# EAGLE design PIC-adresseur - SuperCAST (EAGLE 9.5.2)
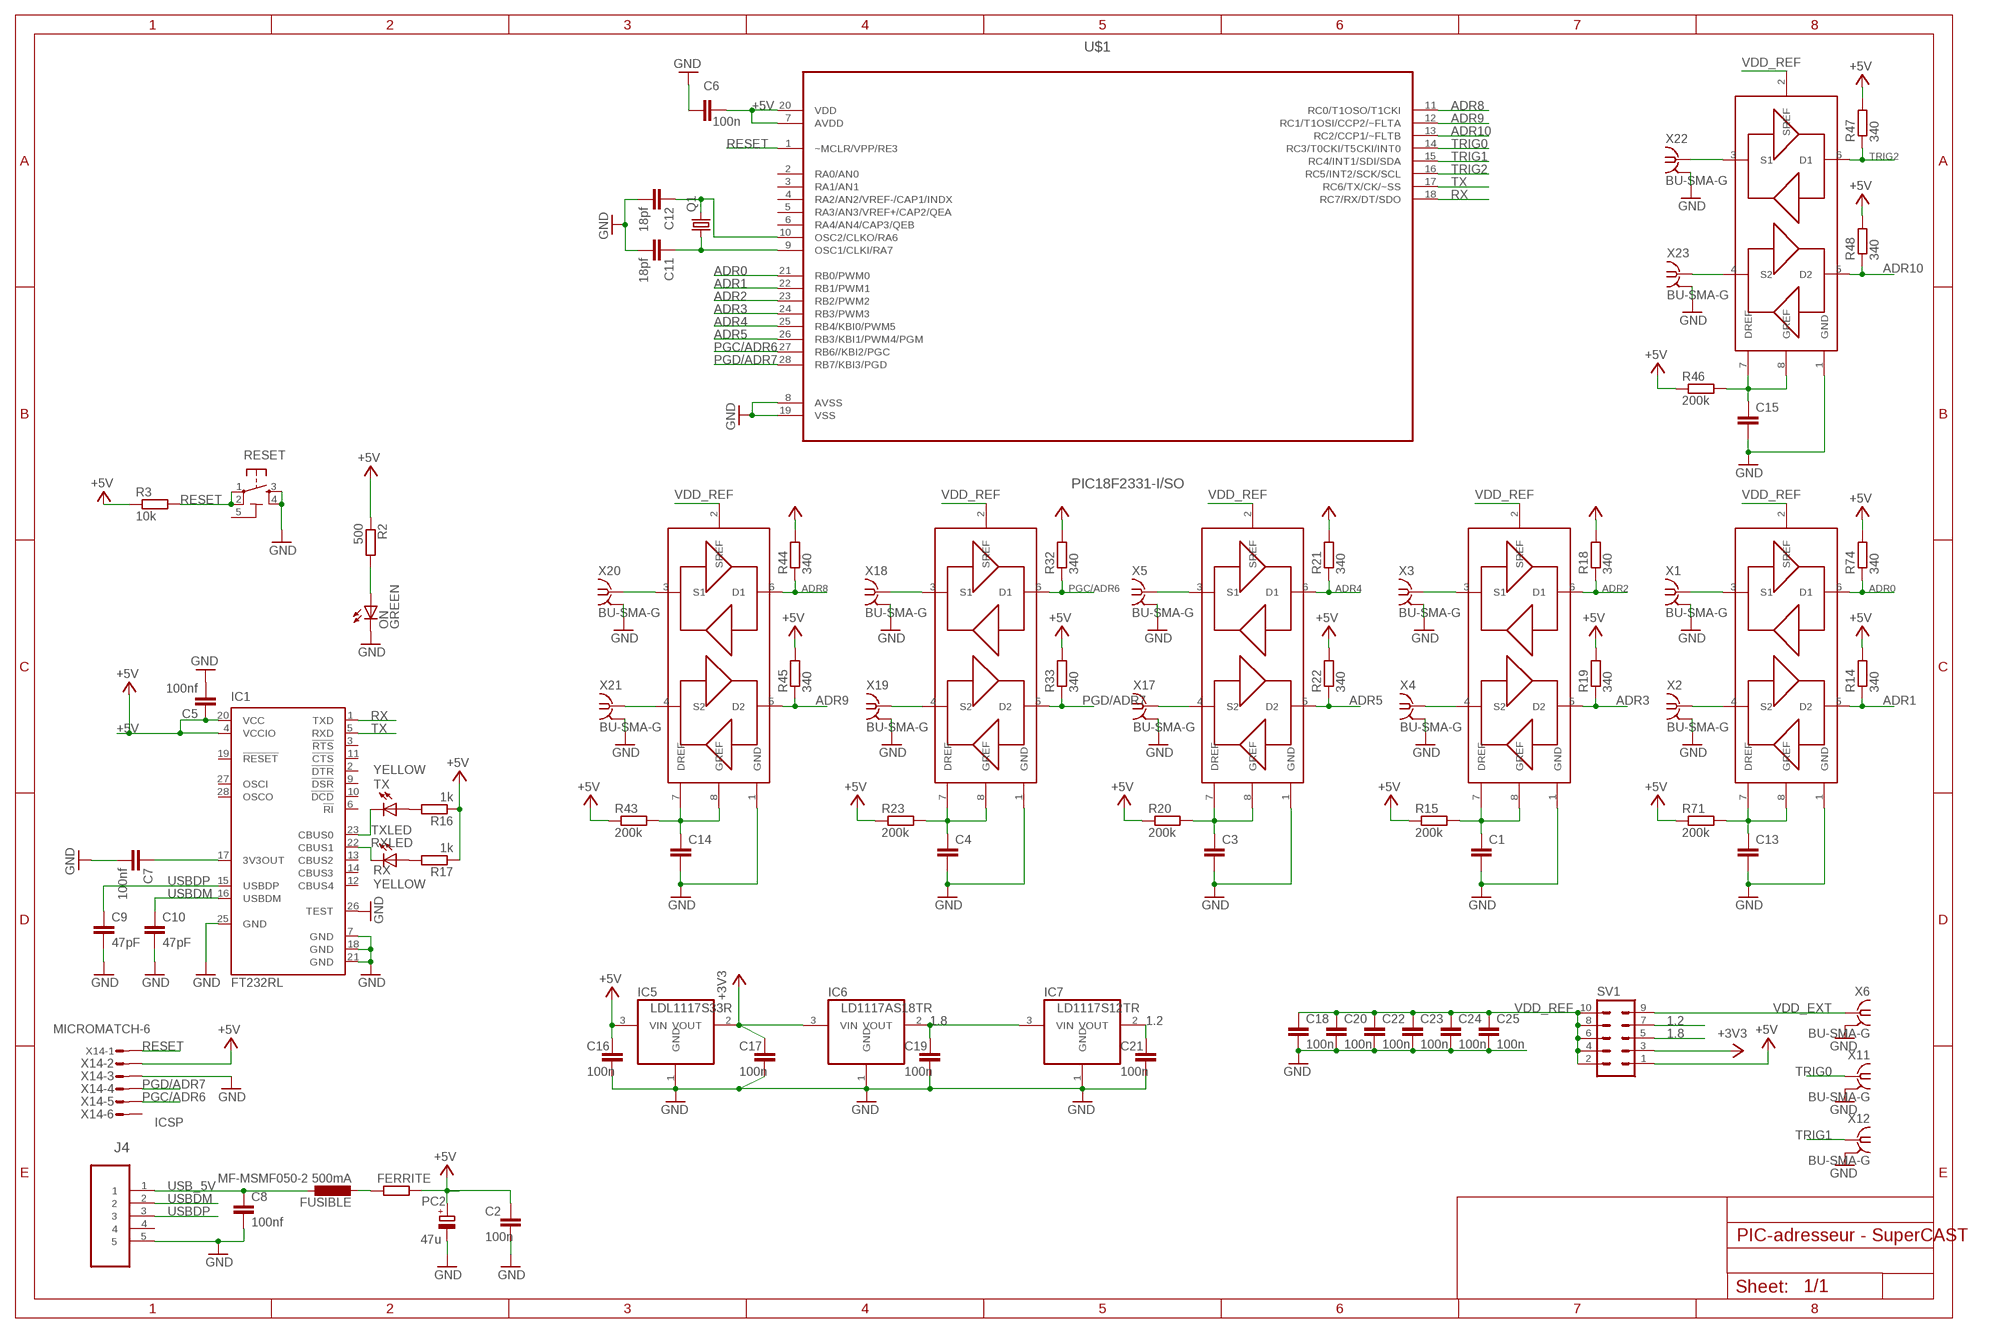
[diagram p0: schematic, sheet 1]

## Parts
C1  C-EUC0603  [C0603]
C2  100n  C-EU0603-RND  [C0603-ROUND]
C3  C-EUC0603  [C0603]
C4  C-EUC0603  [C0603]
C5  100nf  C-EUC0603  [C0603]
C6  100n  C-EUC0603K  [C0603K]
C7  100nf  C-EUC0603  [C0603]
C8  100nf  C-EUC0603  [C0603]
C9  47pF  C-EUC0603  [C0603]
C10  47pF  C-EUC0603  [C0603]
C11  18pf  C-EUC0603  [C0603]
C12  18pf  C-EUC0603  [C0603]
C13  C-EUC0603  [C0603]
C14  C-EUC0603  [C0603]
C15  C-EUC0603  [C0603]
C16  100n  C-EU0603-RND  [C0603-ROUND]
C17  100n  C-EU0603-RND  [C0603-ROUND]
C18  100n  C-EUC0603  [C0603]
C19  100n  C-EU0603-RND  [C0603-ROUND]
C20  100n  C-EUC0603  [C0603]
C21  100n  C-EU0603-RND  [C0603-ROUND]
C22  100n  C-EUC0603  [C0603]
C23  100n  C-EUC0603  [C0603]
C24  100n  C-EUC0603  [C0603]
C25  100n  C-EUC0603  [C0603]
FERRITE  R-EU_M0805  [M0805]
FUSIBLE  MF-MSMF050-2 500mA  L-EUL1812  [L1812]
IC1  FT232RL  [SSOP28]
IC5  LDL1117S33R  REG1117  [SOT223]
IC6  LD1117AS18TR  REG1117  [SOT223]
IC7  LD1117S12TR  REG1117  [SOT223]
J4  47346-0001  [MOLEX_47346-0001]
LV_LVLC1  GTL2002DP_118  [GTL2002DP_118]
LV_LVLC2  GTL2002DP_118  [GTL2002DP_118]
LV_LVLC3  GTL2002DP_118  [GTL2002DP_118]
LV_LVLC4  GTL2002DP_118  [GTL2002DP_118]
LV_LVLC5  GTL2002DP_118  [GTL2002DP_118]
LV_LVLC6  GTL2002DP_118  [GTL2002DP_118]
ON  GREEN  LEDCHIP-LED0805  [CHIP-LED0805]
PC2  47u  CPOL-EUD  [PANASONIC_D]
Q1  CRYSTALSM49  [SM49]
R2  500  R-EU_R0603  [R0603]
R3  10k  R-EU_R0603  [R0603]
R14  340  R-EU_R0603  [R0603]
R15  200k  R-EU_R0603  [R0603]
R16  1k  R-EU_R0603  [R0603]
R17  1k  R-EU_R0603  [R0603]
R18  340  R-EU_R0603  [R0603]
R19  340  R-EU_R0603  [R0603]
R20  200k  R-EU_R0603  [R0603]
R21  340  R-EU_R0603  [R0603]
R22  340  R-EU_R0603  [R0603]
R23  200k  R-EU_R0603  [R0603]
R32  340  R-EU_R0603  [R0603]
R33  340  R-EU_R0603  [R0603]
R43  200k  R-EU_R0603  [R0603]
R44  340  R-EU_R0603  [R0603]
R45  340  R-EU_R0603  [R0603]
R46  200k  R-EU_R0603  [R0603]
R47  340  R-EU_R0603  [R0603]
R48  340  R-EU_R0603  [R0603]
R71  200k  R-EU_R0603  [R0603]
R74  340  R-EU_R0603  [R0603]
RESET  TS42031-160R-TR-7260  TS42  [TS42]
RX  YELLOW  LEDCHIP-LED0805  [CHIP-LED0805]
SV1  MA05-2  [MA05-2]
TX  YELLOW  LEDCHIP-LED0805  [CHIP-LED0805]
U$1  PIC18F2331-I/SO  [SOIC127P1030X265-28N]
X1  BU-SMA-G  [BU-SMA-G]
X2  BU-SMA-G  [BU-SMA-G]
X3  BU-SMA-G  [BU-SMA-G]
X4  BU-SMA-G  [BU-SMA-G]
X5  BU-SMA-G  [BU-SMA-G]
X6  BU-SMA-G  [BU-SMA-G]
X11  BU-SMA-G  [BU-SMA-G]
X12  BU-SMA-G  [BU-SMA-G]
X14  MICROMATCH-6  [MICROMATCH-6]
X17  BU-SMA-G  [BU-SMA-G]
X18  BU-SMA-G  [BU-SMA-G]
X19  BU-SMA-G  [BU-SMA-G]
X20  BU-SMA-G  [BU-SMA-G]
X21  BU-SMA-G  [BU-SMA-G]
X22  BU-SMA-G  [BU-SMA-G]
X23  BU-SMA-G  [BU-SMA-G]

## Nets
1.2: C21.2 IC7.2(VOUT) SV1.7
1.8: C19.2 IC6.2(VOUT) IC7.3(VIN) SV1.5
+3V3: C17.2 IC5.2(VOUT) IC6.3(VIN) SV1.3
+5V [usbvcc]: C2.2 C5.1 C6.2 C16.2 FERRITE.2 IC1.4(VCCIO) IC1.20(VCC) IC5.3(VIN) PC2.+ R2.1 R3.1 R14.2 R15.1 R16.1 R17.1 R18.2 R19.2 R20.1 R21.2 R22.2 R23.1 R32.2 R33.2 R43.1 R44.2 R45.2 R46.1 R47.2 R48.2 R71.1 R74.2 SV1.1 U$1.7(AVDD) U$1.20(VDD) X14.2
ADR0: LV_LVLC2.6(D1) R74.1 U$1.21(RB0/PWM0)
ADR0OUT: LV_LVLC2.3(S1) X1.1
ADR1: LV_LVLC2.5(D2) R14.1 U$1.22(RB1/PWM1)
ADR1OUT: LV_LVLC2.4(S2) X2.1
ADR2: LV_LVLC1.6(D1) R18.1 U$1.23(RB2/PWM2)
ADR2OUT: LV_LVLC1.3(S1) X3.1
ADR3: LV_LVLC1.5(D2) R19.1 U$1.24(RB3/PWM3)
ADR3OUT: LV_LVLC1.4(S2) X4.1
ADR4: LV_LVLC3.6(D1) R21.1 U$1.25(RB4/KBI0/PWM5)
ADR4OUT: LV_LVLC3.3(S1) X5.1
ADR5: LV_LVLC3.5(D2) R22.1 U$1.26(RB3/KBI1/PWM4/PGM)
ADR5OUT: LV_LVLC3.4(S2) X17.1
ADR6OUT: LV_LVLC4.3(S1) X18.1
ADR7OUT: LV_LVLC4.4(S2) X19.1
ADR8: LV_LVLC5.6(D1) R44.1 U$1.11(RC0/T1OSO/T1CKI)
ADR8OUT: LV_LVLC5.3(S1) X20.1
ADR9: LV_LVLC5.5(D2) R45.1 U$1.12(RC1/T1OSI/CCP2/~FLTA)
ADR9OUT: LV_LVLC5.4(S2) X21.1
ADR10: LV_LVLC6.5(D2) R48.1 U$1.13(RC2/CCP1/~FLTB)
ADR10OUT: LV_LVLC6.4(S2) X23.1
GND [gnd]: C1.2 C2.1 C3.2 C4.2 C5.2 C6.1 C7.2 C8.2 C9.2 C10.2 C11.2 C12.2 C13.2 C14.2 C15.2 C16.1 C17.1 C18.2 C19.1 C20.2 C21.1 C22.2 C23.2 C24.2 C25.2 IC1.7(GND) IC1.18(GND) IC1.21(GND) IC1.25(GND) IC1.26(TEST) IC5.1(GND) IC6.1(GND) IC7.1(GND) J4.5 LV_LVLC1.1(GND) LV_LVLC2.1(GND) LV_LVLC3.1(GND) LV_LVLC4.1(GND) LV_LVLC5.1(GND) LV_LVLC6.1(GND) ON.C PC2.- RESET.3 RESET.4 U$1.8(AVSS) U$1.19(VSS) X1.2 X1.3 X1.4 X1.5 X2.2 X2.3 X2.4 X2.5 X3.2 X3.3 X3.4 X3.5 X4.2 X4.3 X4.4 X4.5 X5.2 X5.3 X5.4 X5.5 X6.2 X6.3 X6.4 X6.5 X11.2 X11.3 X11.4 X11.5 X12.2 X12.3 X12.4 X12.5 X14.3 X17.2 X17.3 X17.4 X17.5 X18.2 X18.3 X18.4 X18.5 X19.2 X19.3 X19.4 X19.5 X20.2 X20.3 X20.4 X20.5 X21.2 X21.3 X21.4 X21.5 X22.2 X22.3 X22.4 X22.5 X23.2 X23.3 X23.4 X23.5
N$3: ON.A R2.2
N$16: C7.1 IC1.17(3V3OUT)
N$17: C1.1 LV_LVLC1.7(DREF) LV_LVLC1.8(GREF) R15.2
N$18: FERRITE.1 FUSIBLE.2
N$20: C3.1 LV_LVLC3.7(DREF) LV_LVLC3.8(GREF) R20.2
N$31: C4.1 LV_LVLC4.7(DREF) LV_LVLC4.8(GREF) R23.2
N$33: C14.1 LV_LVLC5.7(DREF) LV_LVLC5.8(GREF) R43.2
N$35: R17.2 RX.A
N$36: R16.2 TX.A
N$37: C15.1 LV_LVLC6.7(DREF) LV_LVLC6.8(GREF) R46.2
N$119: C13.1 LV_LVLC2.7(DREF) LV_LVLC2.8(GREF) R71.2
PGC/ADR6: LV_LVLC4.6(D1) R32.1 U$1.27(RB6//KBI2/PGC) X14.5
PGD/ADR7: LV_LVLC4.5(D2) R33.1 U$1.28(RB7/KBI3/PGD) X14.4
RESET: R3.2 RESET.1 RESET.2 U$1.1(~MCLR/VPP/RE3) X14.1
RX: IC1.1(TXD) U$1.18(RC7/RX/DT/SDO)
RXLED: IC1.22(CBUS1) RX.C
TRIG0: U$1.14(RC3/T0CKI/T5CKI/INT0) X11.1
TRIG1: U$1.15(RC4/INT1/SDI/SDA) X12.1
TRIG2: LV_LVLC6.6(D1) R47.1 U$1.16(RC5/INT2/SCK/SCL)
TRIG2OUT: LV_LVLC6.3(S1) X22.1
TX: IC1.5(RXD) U$1.17(RC6/TX/CK/~SS)
TXLED: IC1.23(CBUS0) TX.C
USB_5V: C8.1 FUSIBLE.1 J4.1
USBDM: C10.1 IC1.16(USBDM) J4.2
USBDP: C9.1 IC1.15(USBDP) J4.3
VDD_EXT: SV1.9 X6.1
VDD_REF: C18.1 C20.1 C22.1 C23.1 C24.1 C25.1 LV_LVLC1.2(SREF) LV_LVLC2.2(SREF) LV_LVLC3.2(SREF) LV_LVLC4.2(SREF) LV_LVLC5.2(SREF) LV_LVLC6.2(SREF) SV1.2 SV1.4 SV1.6 SV1.8 SV1.10
XTAL1: C12.1 Q1.2 U$1.10(OSC2/CLKO/RA6)
XTAL2: C11.1 Q1.1 U$1.9(OSC1/CLKI/RA7)
Unconnected: IC1.2(!DTR) IC1.3(!RTS) IC1.6(!RI) IC1.9(!DSR) IC1.10(!DCD) IC1.11(!CTS) IC1.12(CBUS4) IC1.13(CBUS2) IC1.14(CBUS3) IC1.19(!RESET) IC1.27(OSCI) IC1.28(OSCO) J4.4 U$1.2(RA0/AN0) U$1.3(RA1/AN1) U$1.4(RA2/AN2/VREF-/CAP1/INDX) U$1.5(RA3/AN3/VREF+/CAP2/QEA) U$1.6(RA4/AN4/CAP3/QEB) X14.6

## Notes on the sheet
- ICSP

## Power pins joined to a net without a drawn wire
5-GND: RESET.5(5-GND)

## Library data of the parts
C1 C3 C4 C13-C15 = rcl:C-EU: CAPACITOR, European symbol; SPICEPREFIX: C
C2 C6 C16 C17 C19 C21 = SmartPrj:C-EU: CAPACITOR, European symbol; OC_FARNELL: 2210925
C5 C7 C8 C18 C20 C22-C25 = LibPerso:C-EU: CAPACITOR, European symbol; OC_FARNELL: 2210925
C9 C10 = LibPerso:C-EU: CAPACITOR, European symbol; OC_FARNELL: 1740601
C11 C12 = LibPerso:C-EU: CAPACITOR, European symbol; OC_FARNELL: 1740595
FERRITE = LibPerso:R-EU_: RESISTOR, European symbol; OC_FARNELL: 2292459
FUSIBLE = rcl:L-EU: INDUCTOR, European symbol; OC_FARNELL: 2396061
IC1 = ftdichip:FT232R: Source: http://www.ftdichip.com/Documents/DataSheets/DS_FT232R_v104.pdf; MPN: FT232RL; OC_FARNELL: 1146032; OC_NEWARK: 91K9918
IC5 = burr-brown:REG1117: 800mA and 1A Low Dropout (LDO) Positive Regulator 1.8V, 2.5V, 2.85V, 3.3V, 5V, and Adj; OC_FARNELL: 2729708
IC6 = burr-brown:REG1117: 800mA and 1A Low Dropout (LDO) Positive Regulator 1.8V, 2.5V, 2.85V, 3.3V, 5V, and Adj; OC_FARNELL: 1467775
IC7 = burr-brown:REG1117: 800mA and 1A Low Dropout (LDO) Positive Regulator 1.8V, 2.5V, 2.85V, 3.3V, 5V, and Adj; OC_FARNELL: 1467778
J4 = LibPerso:47346-0001: CONN RCPT 5POS MICRO USB R/A SMD; MPN: 47346-0001; OC_FARNELL: 1568026; OC_NEWARK: 47M0505; PACKAGE: 5 POS MICRO USB R/A; SUPPLIER: MOLEX
LV_LVLC1 = zitewo:GTL2002DP_118; OC8FARNELL: 2400476
LV_LVLC2-LV_LVLC6 = zitewo:GTL2002DP_118; OC_FARNELL: 2400476
ON = led:LED: LED OSRAM: - CHIPLED LG R971, LG N971, LY N971, LG Q971, LY Q971, LO R971, LY R971 LH N974, LH R974 LS Q976, LO Q976, LY Q976 LO Q996 - Hyper CHIPLED LW Q18S LB Q993, LB Q99A, LB R99A - SideLED LS A670, LO A670, LY A670, LG A670, LP A670 LB A673, LV A673, LT A673, LW A673 LH A674 LY A675 LS A676, LA A676, LO A676, LY A676, LW A676 LS A679, LY A679, LG A679 - Hyper Micro SIDELED® LS Y876, LA Y876, LO Y876, LY Y876 LT Y87S - SmartLED LW L88C, LW L88S LB L89C, LB L89S, LG L890 LS L89K, LO L89K, LY L89K LS L896, LA L896, LO L896, LY L896 - TOPLED LS T670, LO T670, LY T670, LG T670, LP T670 LSG T670, LSP T670, LSY T670, LOP T670, LYG T670 LG T671, LOG T671, LSG T671 LB T673, LV T673, LT T673, LW T673 LH T674 LS T676, LA T676, LO T676, LY T676, LB T676, LH T676, LSB T676, LW T676 LB T67C, LV T67C, LT T67C, LS T67K, LO T67K, LY T67K, LW E67C LS E67B, LA E67B, LO E67B, LY E67B, LB E67C, LV E67C, LT E67C LW T67C LS T679, LY T679, LG T679 LS T770, LO T770, LY T770, LG T770, LP T770 LB T773, LV T773, LT T773, LW T773 LH T774 LS E675, LA E675, LY E675, LS T675 LS T776, LA T776, LO T776, LY T776, LB T776 LHGB T686 LT T68C, LB T68C - Hyper Mini TOPLED® LB M676 - Mini TOPLED Santana® LG M470 LS M47K, LO M47K, LY M47K Source: http://www.osram.convergy.de LUXEON: - LUMILED® LXK2-PW12-R00, LXK2-PW12-S00, LXK2-PW14-U00, LXK2-PW14-V00 LXK2-PM12-R00, LXK2-PM12-S00, LXK2-PM14-U00 LXK2-PE12-Q00, LXK2-PE12-R00, LXK2-PE12-S00, LXK2-PE14-T00, LXK2-PE14-U00 LXK2-PB12-K00, LXK2-PB12-L00, LXK2-PB12-M00, LXK2-PB14-N00, LXK2-PB14-P00, LXK2-PB14-Q00 LXK2-PR12-L00, LXK2-PR12-M00, LXK2-PR14-Q00, LXK2-PR14-R00 LXK2-PD12-Q00, LXK2-PD12-R00, LXK2-PD12-S00 LXK2-PH12-R00, LXK2-PH12-S00 LXK2-PL12-P00, LXK2-PL12-Q00, LXK2-PL12-R00 Source: www.luxeon.com KINGBRIGHT: KA-3528ASYC Source: www.kingbright.com; OC_FARNELL: 8529906
PC2 = rcl:CPOL-EU: POLARIZED CAPACITOR, European symbol; OC_FARNELL: 1850100
Q1 = crystal:CRYSTAL: CRYSTAL; OC_FARNELL: 1842273; OC_NEWARK: unknown
R2 R3 R16 R17 = LibPerso:R-EU_: RESISTOR, European symbol; OC_FARNELL: 9331697
R14 R15 R18-R23 R32 R33 R43-R48 R71 R74 = rcl:R-EU_: RESISTOR, European symbol; SPICEPREFIX: R
RESET = SmartPrj:TS42: TS42 Dongnan Electronics Tact switch VDC 12V - 50mA; OC_FARNELL: 2060823
RX TX = led:LED: LED OSRAM: - CHIPLED LG R971, LG N971, LY N971, LG Q971, LY Q971, LO R971, LY R971 LH N974, LH R974 LS Q976, LO Q976, LY Q976 LO Q996 - Hyper CHIPLED LW Q18S LB Q993, LB Q99A, LB R99A - SideLED LS A670, LO A670, LY A670, LG A670, LP A670 LB A673, LV A673, LT A673, LW A673 LH A674 LY A675 LS A676, LA A676, LO A676, LY A676, LW A676 LS A679, LY A679, LG A679 - Hyper Micro SIDELED® LS Y876, LA Y876, LO Y876, LY Y876 LT Y87S - SmartLED LW L88C, LW L88S LB L89C, LB L89S, LG L890 LS L89K, LO L89K, LY L89K LS L896, LA L896, LO L896, LY L896 - TOPLED LS T670, LO T670, LY T670, LG T670, LP T670 LSG T670, LSP T670, LSY T670, LOP T670, LYG T670 LG T671, LOG T671, LSG T671 LB T673, LV T673, LT T673, LW T673 LH T674 LS T676, LA T676, LO T676, LY T676, LB T676, LH T676, LSB T676, LW T676 LB T67C, LV T67C, LT T67C, LS T67K, LO T67K, LY T67K, LW E67C LS E67B, LA E67B, LO E67B, LY E67B, LB E67C, LV E67C, LT E67C LW T67C LS T679, LY T679, LG T679 LS T770, LO T770, LY T770, LG T770, LP T770 LB T773, LV T773, LT T773, LW T773 LH T774 LS E675, LA E675, LY E675, LS T675 LS T776, LA T776, LO T776, LY T776, LB T776 LHGB T686 LT T68C, LB T68C - Hyper Mini TOPLED® LB M676 - Mini TOPLED Santana® LG M470 LS M47K, LO M47K, LY M47K Source: http://www.osram.convergy.de LUXEON: - LUMILED® LXK2-PW12-R00, LXK2-PW12-S00, LXK2-PW14-U00, LXK2-PW14-V00 LXK2-PM12-R00, LXK2-PM12-S00, LXK2-PM14-U00 LXK2-PE12-Q00, LXK2-PE12-R00, LXK2-PE12-S00, LXK2-PE14-T00, LXK2-PE14-U00 LXK2-PB12-K00, LXK2-PB12-L00, LXK2-PB12-M00, LXK2-PB14-N00, LXK2-PB14-P00, LXK2-PB14-Q00 LXK2-PR12-L00, LXK2-PR12-M00, LXK2-PR14-Q00, LXK2-PR14-R00 LXK2-PD12-Q00, LXK2-PD12-R00, LXK2-PD12-S00 LXK2-PH12-R00, LXK2-PH12-S00 LXK2-PL12-P00, LXK2-PL12-Q00, LXK2-PL12-R00 Source: www.luxeon.com KINGBRIGHT: KA-3528ASYC Source: www.kingbright.com; OC_FARNELL: 1686073
SV1 = con-lstb:MA05-2: PIN HEADER; OC_FARNELL: unknown; OC_NEWARK: unknown
U$1 = Microchip_By_element14_Batch_1:PIC18F2331-I/SO: High-Performance Enhanced Flash Microcontrollers; MPN: PIC18F2331-I/SO; OC_FARNELL: -; OC_NEWARK: 89H0559; PACKAGE: SOIC-28; SUPPLIER: Microchip
X1-X6 X11 X12 X17-X23 = con-coax:BU-SMA-G: FEMALE SMA CONNECTOR Radiall distributor RS 193-9117; OC_FARNELL: 1248989; OC_NEWARK: unknown
X14 = con-amp-micromatch:MICROMATCH-6: MicroMaTch 6 7-215464-6 / 0-215464-6 Drawing Number C-215464 DDEController.pdf; MPN: 7-215464-6; OC_FARNELL: 3784630; OC_NEWARK: 19R8125

## Net classes
1 power: width 0.61 mm, drill 0.61 mm, clearance 0.254 mm
2 gnd: width 0.305 mm, drill 0.559 mm, clearance 0.254 mm
3 usbvcc: width 0.508 mm, drill 0.61 mm, clearance 0.254 mm
4 aref: width 0.406 mm, drill 0.61 mm, clearance 0.254 mm

## Board
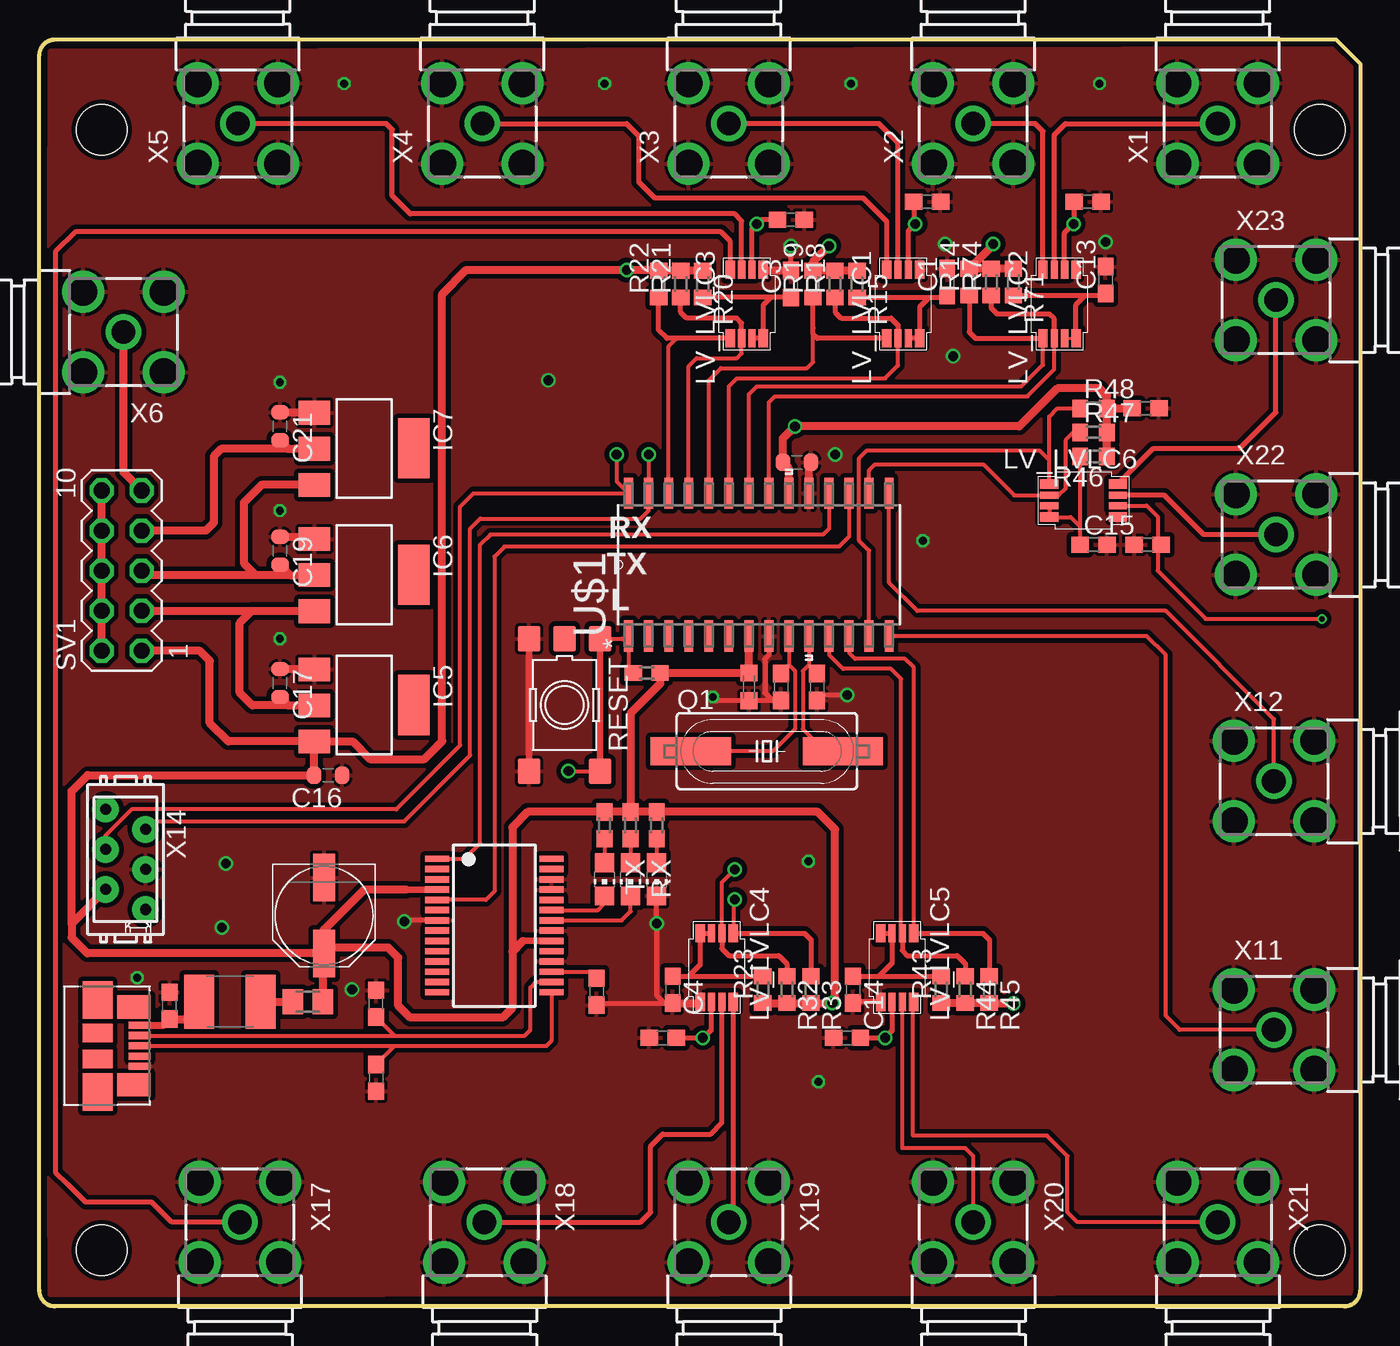
[diagram p1: board, top side]
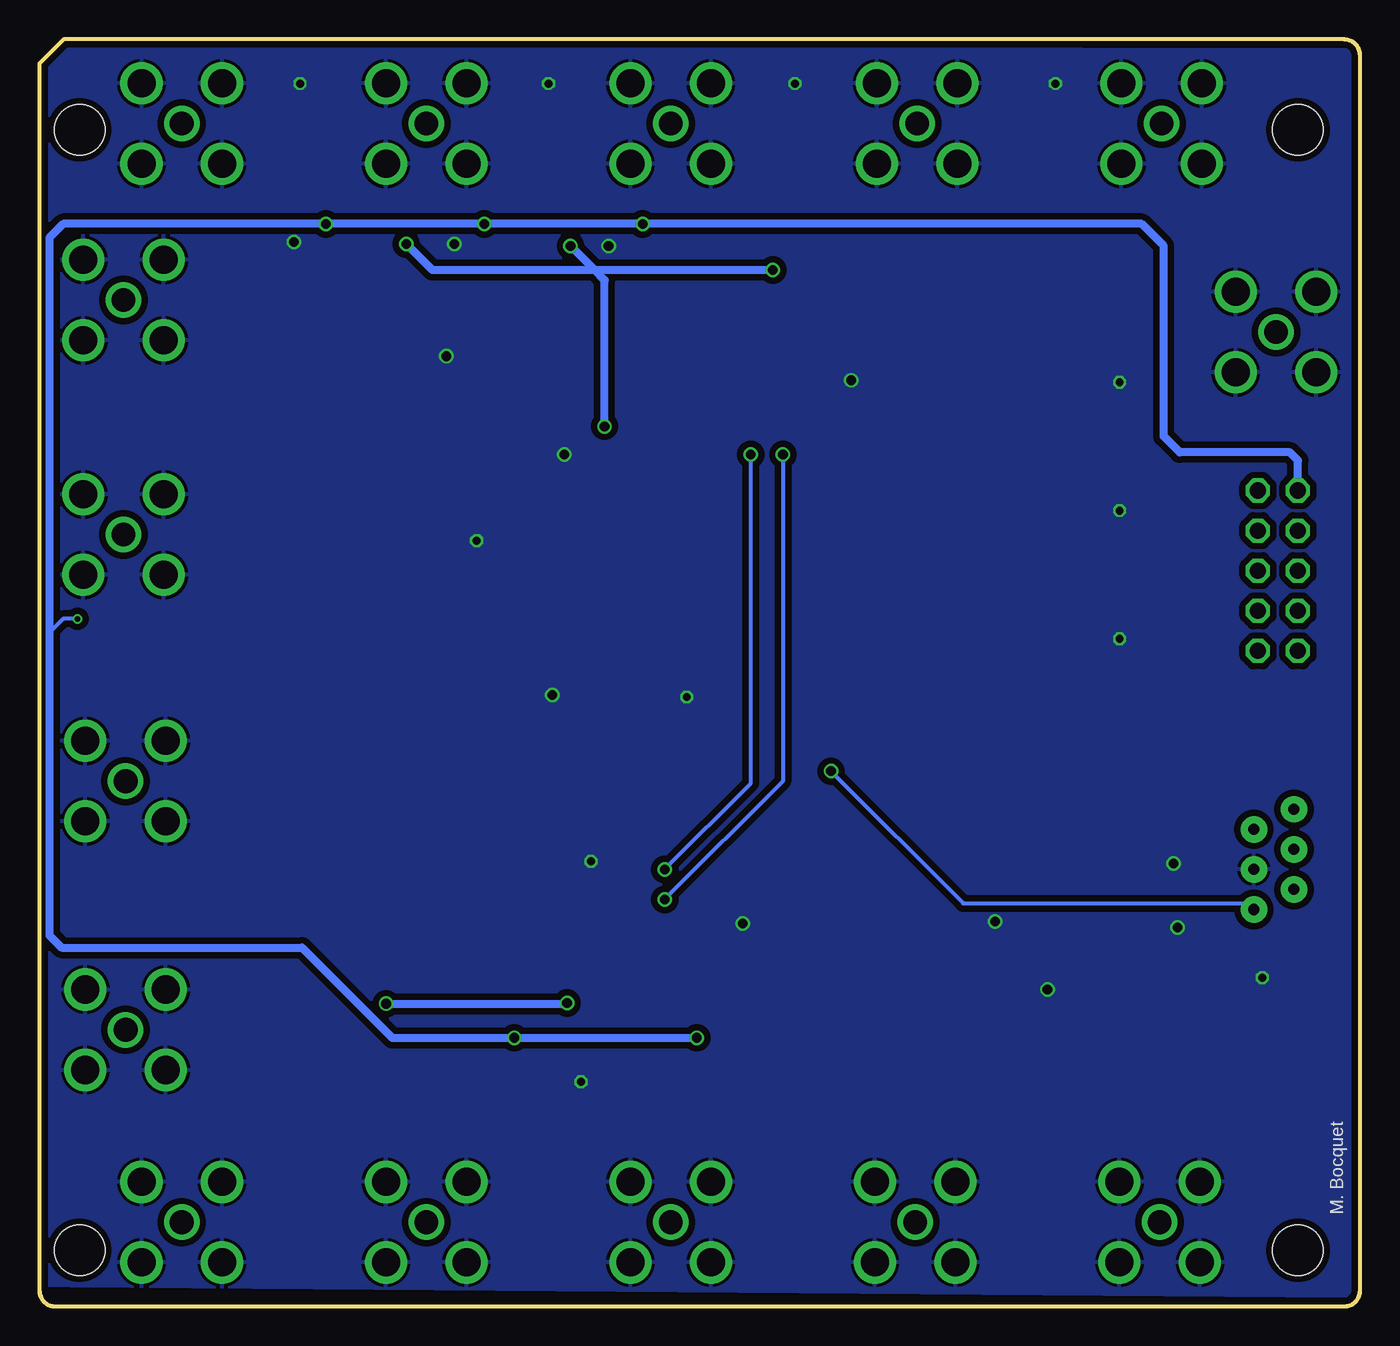
[diagram p2: board, bottom side, seen from below]

Size 83.69 x 80.26 mm. Coordinates in mm from the lower left corner, seen from the top.
Outline: 82.17,80.26 83.69,78.74 83.69,1 arc-90 82.69,0 1,0 arc-90 0,1 0,79.26 arc-90 1,80.26 82.17,80.26
Copper layers (1*16): Top 0.018mm / dielectric 1.55mm / Bottom 0.018mm
Design rules "eC_2Layer_PClass6_BaseCopperO18_eCDefault": minimum track width 0.15mm, minimum drill 0.35mm, track to track 0.15mm, track to pad 0.15mm, pad to pad 0.15mm, via to via 0.15mm, smd to smd 0mil, copper to edge 0.25mm, drill to drill 0.35mm, minimum pad ring 0.175mm, minimum via ring 0.125mm, stop-mask expansion 0mil, vias tented up to drill 0.45mm, thermal gap 0.2mm
Holes 3.2 mm at 81.15,74.55 81.15,3.56 3.94,3.56 3.94,74.55

### Footprints (pad centres in the part's own frame; a part is rotated, then mirrored left to right if it is on the bottom)
C0603 = smd 1.1 x 1: 1 -0.85,0; 2 0.85,0
C0603-ROUND = smd 0.898 x 1.1: 1 -0.889,0; 2 0.889,0
C0603K = smd 1.05 x 1.08: 1 -0.875,0; 2 0.875,0
M0805 = smd 1.3 x 1.6: 1 -0.95,0; 2 0.95,0
L1812 = smd 1.9 x 3.4: 1 -1.95,0; 2 1.95,0
SSOP28 = smd 0.4 x 1.5: 1 -4.225,-3.625; 2 -3.575,-3.625; 3 -2.925,-3.625; 4 -2.275,-3.625; 5 -1.625,-3.625; 6 -0.975,-3.625; 7 -0.325,-3.625; 8 0.325,-3.625; 9 0.975,-3.625; 10 1.625,-3.625; 11 2.275,-3.625; 12 2.925,-3.625; 13 3.575,-3.625; 14 4.225,-3.625; 15 4.225,3.625; 16 3.575,3.625; 17 2.925,3.625; 18 2.275,3.625; 19 1.625,3.625; 20 0.975,3.625; 21 0.325,3.625; 22 -0.325,3.625; 23 -0.975,3.625; 24 -1.625,3.625; 25 -2.275,3.625; 26 -2.925,3.625; 27 -3.575,3.625; 28 -4.225,3.625
SOT223 = smd 1.499 x 2.007: 1 -2.261,-3.15; 2 0.025,-3.15; 3 2.311,-3.15 | smd 3.81 x 2.007: 4 0,3.15
MOLEX_47346-0001 = smd 0.45 x 1.38: 1 -1.3,0; 2 -0.65,0; 3 0,0; 4 0.65,0; 5 1.3,0 | smd 1.475 x 2.1: M1 -2.462,-0.36; M2 2.462,-0.36 | smd 2.375 x 1.9: M3 -2.913,-2.66; M6 2.913,-2.66 | smd 1.175 x 1.9: M4 -0.82,-2.66; M5 0.85,-2.66
GTL2002DP_118 = smd 1.15 x 0.6: 1 -2.175,1.05; 4 -2.175,-1.05; 5 2.175,-1.05; 8 2.175,1.05 | smd 1.15 x 0.45: 2 -2.175,0.325; 3 -2.175,-0.325; 6 2.175,-0.325; 7 2.175,0.325
CHIP-LED0805 = smd 1.2 x 1.2: A 0,-1.05; C 0,1.05
PANASONIC_D = smd 3 x 1.4: + 2.4,0; - -2.4,0
SM49 = smd 5.08 x 1.778: 1 -4.826,0; 2 4.826,0
R0603 = smd 1.1 x 1: 1 -0.85,0; 2 0.85,0
R0603' = smd 1 x 1.1: 1 -0.85,0; 2 0.85,0
TS42 = smd 1.6 x 1.4: 1 -4.2,2.25; 2 4.2,2.25; 3 -4.2,-2.25; 4 4.2,-2.25; 5 -4.2,0
MA05-2 = drill 1.016 octagon: 1 -5.08,-1.27; 2 -5.08,1.27; 3 -2.54,-1.27; 4 -2.54,1.27; 5 0,-1.27; 6 0,1.27; 7 2.54,-1.27; 8 2.54,1.27; 9 5.08,-1.27; 10 5.08,1.27
SOIC127P1030X265-28N = smd 1.981 x 0.559: 1 -4.521,8.255; 2 -4.521,6.985; 3 -4.521,5.715; 4 -4.521,4.445; 5 -4.521,3.175; 6 -4.521,1.905; 7 -4.521,0.635; 8 -4.521,-0.635; 9 -4.521,-1.905; 10 -4.521,-3.175; 11 -4.521,-4.445; 12 -4.521,-5.715; 13 -4.521,-6.985; 14 -4.521,-8.255; 15 4.521,-8.255; 16 4.521,-6.985; 17 4.521,-5.715; 18 4.521,-4.445; 19 4.521,-3.175; 20 4.521,-1.905; 21 4.521,-0.635; 22 4.521,0.635; 23 4.521,1.905; 24 4.521,3.175; 25 4.521,4.445; 26 4.521,5.715; 27 4.521,6.985; 28 4.521,8.255
BU-SMA-G = drill 1.5: 1 0,0 | drill 1.778: 2 -2.55,2.55; 3 2.55,2.55; 4 2.55,-2.55; 5 -2.55,-2.55
MICROMATCH-6 = drill 0.7 pad 1.676: 1 3.175,1.27; 2 1.905,-1.27; 3 0.635,1.27; 4 -0.635,-1.27; 5 -1.905,1.27; 6 -3.175,-1.27

### Placement (x,y rotation side)
C1  57.53,64.9 90 top
C2  48.01,53.47 180 top
C3  47.62,64.77 90 top
C4  40.13,20.07 270 top
C5  70.1,56.9 0 top
C6  44.96,39.24 90 top
C7  35.31,19.94 270 top
C8  8.25,19.05 90 top
C9  21.34,14.48 270 top
C10  21.34,19.18 90 top
C11  46.99,39.24 270 top
C12  49.28,39.24 270 top
C13  67.56,65.02 90 top
C14  51.56,20.07 270 top
C15  66.8,48.26 0 top
C16  18.29,33.66 180 top
C17  15.24,39.5 270 top
C18  47.62,68.83 0 top
C19  15.24,47.88 270 top
C20  56.26,69.98 0 top
C21  15.24,55.75 270 top
C22  66.42,69.98 0 top
C23  70.23,48.26 180 top
C24  51.18,17.02 180 top
C25  39.5,17.02 180 top
FERRITE  17.02,19.3 0 top
FUSIBLE  12.07,19.3 0 top
IC1  28.83,24.13 270 top
IC5  20.57,38.1 270 top
IC6  20.57,46.35 270 top
IC7  20.57,54.36 270 top
J4  6.35,16.51 270 top
LV_LVLC1  54.74,63.5 270 top
LV_LVLC2  64.64,63.5 270 top
LV_LVLC3  44.83,63.5 270 top
LV_LVLC4  42.93,21.46 90 top
LV_LVLC5  54.36,21.46 90 top
LV_LVLC6  66.17,51.05 180 top
ON  39.12,27.05 180 top
PC2  18.03,24.77 270 top
Q1  46.1,35.18 0 top
R2  39.12,30.48 270 top
R3  38.48,40.13 180 top
R14  340  [R0603']  58.93,64.9 90 top
R15  200k  [R0603']  51.82,64.77 270 top
R16  35.81,30.48 270 top
R17  37.46,30.48 270 top
R18  340  [R0603']  50.42,64.77 90 top
R19  340  [R0603']  49.02,64.77 90 top
R20  200k  [R0603']  42.04,64.77 270 top
R21  340  [R0603']  40.64,64.77 90 top
R22  340  [R0603']  39.24,64.77 90 top
R23  200k  [R0603']  45.85,20.07 90 top
R32  340  [R0603']  47.37,20.07 270 top
R33  340  [R0603']  48.89,20.07 270 top
R43  200k  [R0603']  57.15,20.07 90 top
R44  340  [R0603']  58.67,20.07 270 top
R45  340  [R0603']  60.2,20.07 270 top
R46  200k  [R0603']  66.8,53.85 180 top
R47  340  [R0603']  66.8,55.37 0 top
R48  340  [R0603']  66.8,56.9 0 top
R71  200k  [R0603']  61.72,64.9 270 top
R74  340  [R0603']  60.33,64.9 90 top
RESET  33.27,38.1 270 top
RX  37.46,27.05 180 top
SV1  5.21,46.61 90 top
TX  35.81,27.05 180 top
U$1  45.59,46.99 90 top
X1  74.68,74.93 90 top
X2  59.18,74.93 90 top
X3  43.69,74.93 90 top
X4  28.07,74.93 90 top
X5  12.57,74.93 90 top
X6  5.33,61.72 180 top
X11  78.23,17.53 0 top
X12  78.23,33.27 0 top
X14  5.46,28.32 270 top
X17  12.7,5.33 270 top
X18  28.19,5.33 270 top
X19  43.69,5.33 270 top
X20  59.18,5.33 270 top
X21  74.68,5.33 270 top
X22  78.36,48.89 0 top
X23  78.36,63.75 0 top

### Tracks (layer width: path | path; a pad name or v marks a point on that pad's centre or on a via)
1.2
  Top 0.508: IC7.2 16.13,54.33 15.77,54.33 | 15.77,54.33 11.53,54.33 11.05,53.85 11.05,49.66 10.54,49.15 SV1.7 | C21.2 15.77,54.33
1.8
  Top 0.508: IC6.2 16.26,46.33 15.9,46.33 | 15.9,46.33 13.72,46.33 | 13.72,46.33 6.76,46.33 SV1.5 | IC7.3 14.07,52.05 12.95,50.93 12.95,47.09 13.72,46.33 | C19.2 15.9,46.33
+3V3
  Top 0.508: IC5.2 16.26,38.07 15.77,38.07 | 15.77,38.07 13.49,38.07 12.7,38.86 12.7,43.31 13.46,44.07 17.4,44.07 IC6.3 6.5,44.04 SV1.3 | C17.2 15.77,38.07
+5V  (via drill 0.61)
  Top 0.406: IC1.4 23.23,26.4 | IC1.20 30.65,23.15
  Top 0.508: R71.1 R74.2 R14.2 60.45,67.27 v60.45,67.31 | R20.1 R21.2 R22.2 39.2,65.66 v37.21,65.66 27.05,65.66 25.53,64.14 25.53,35.81 24.38,34.67 20.96,34.67 19.84,35.79 IC5.3 | R23.1 R32.2 R33.2 v50.25,19.22 50.42,19.56 50.42,30.23 49.31,31.33 R2.1 R17.1 | U$1.7 C6.2 44.94,40.13 R3.1 39.33,39.46 37.46,37.59 R17.1 | R17.1 R16.1 30.95,31.33 29.97,30.35 29.97,22.48 | FERRITE.2 17.97,22.3 PC2.+ | IC5.3 11.96,35.79 10.8,36.96 10.8,40.89 10.16,41.53 SV1.1 | R43.1 R44.2 R45.2 61.68,19.22 v61.72,19.18 | 23.23,26.4 20.56,26.4 18.03,23.88 18.03,22.73 | 18.03,22.73 PC2.+ | IC5.3 17.4,35.76 C16.2 3.05,33.66 2.03,32.64 2.03,24.26 | 29.97,22.48 29.97,18.92 29.34,18.29 23.5,18.29 22.73,19.05 22.73,22.1 22.1,22.73 18.03,22.73 | 30.65,23.15 29.97,22.48 | v50.04,67.18 49.02,66.17 R19.2 R18.2 R15.1 | U$1.20 47.5,53.09 C2.2 47.12,54.99 v47.88,55.75 62.1,55.75 64.52,58.17 67.18,58.17 67.65,57.7 R48.2 | PC2.+ 3.04,22.36 2.03,23.37 2.03,24.26 | X14.2 2.03,24.26 | R46.1 R47.2 R48.2 | R48.2 C5.1
  Bottom 0.508: v50.04,67.18 48.51,65.66 | 48.51,65.66 v37.21,65.66 | v60.45,67.31 58.8,65.66 48.51,65.66 | v47.88,55.75 47.88,65.02 48.51,65.66 | v61.72,19.18 50.12,19.18 v50.25,19.22
ADR0
  Top 0.254: U$1.21 46.23,57.28 46.61,57.66 62.61,57.66 64.32,59.37 LV_LVLC2.6
  Top 0.305: LV_LVLC2.6 64.32,62.55 64.01,62.87 60.71,62.87 60.33,63.25 R74.1
ADR0OUT
  Top 0.305: LV_LVLC2.3 64.32,74.22 65.02,74.93 X1.1
ADR1
  Top 0.254: U$1.22 44.96,57.78 45.47,58.29 62.23,58.29 63.59,59.66 LV_LVLC2.5
  Top 0.305: R14.1 58.93,61.72 59.32,61.32 LV_LVLC2.5
ADR1OUT
  Top 0.305: LV_LVLC2.4 63.59,74.46 63.12,74.93 X2.1
ADR2
  Top 0.254: U$1.23 43.69,58.29 44.2,58.8 53.59,58.8 54.41,59.62 LV_LVLC1.6
  Top 0.305: R18.1 50.42,62.99 50.8,62.61 53.97,62.61 54.41,62.17 LV_LVLC1.6
ADR2OUT
  Top 0.305: LV_LVLC1.3 54.41,73.73 53.21,74.93 X3.1
ADR3
  Top 0.254: U$1.24 42.42,58.67 43.18,59.44 48.64,59.44 49.02,59.82 49.02,61.98
  Top 0.305: LV_LVLC1.5 49.29,61.32 49.02,61.59 49.02,61.98 R19.1
ADR3OUT
  Top 0.305: X4.1 37.21,74.93 37.97,74.17 37.97,71.25 38.99,70.23 52.2,70.23 53.69,68.74 LV_LVLC1.4
ADR4
  Top 0.254: U$1.25 41.15,59.56 41.66,60.07 44.2,60.07 44.51,60.38 LV_LVLC3.6
  Top 0.305: LV_LVLC3.6 44.51,62.3 44.2,62.61 41.02,62.61 40.64,62.99 R21.1
ADR4OUT
  Top 0.305: LV_LVLC3.3 44.51,68.78 44.07,69.22 23.5,69.22 22.35,70.36 22.35,74.55 21.97,74.93 X5.1
ADR5
  Top 0.254: U$1.26 39.88,60.82 40.39,61.32
  Top 0.305: LV_LVLC3.5 40.39,61.32 39.77,61.32 39.24,61.85 R22.1
ADR5OUT
  Top 0.305: X17.1 8.38,5.33 7.11,6.6 2.92,6.6 2.41,7.11 1.78,7.75 1.02,8.51 1.02,66.8 2.29,68.07 43.18,68.07 43.78,67.47 LV_LVLC3.4
ADR6OUT
  Top 0.305: X18.1 38.1,5.33 38.73,5.97 38.73,10.16 39.5,10.92 42.54,10.92 43.25,11.63 LV_LVLC4.3
ADR7OUT
  Top 0.305: X19.1 43.98,5.62 LV_LVLC4.4
ADR8
  Top 0.254: U$1.11 50.04,41.27 50.93,40.39 53.97,40.39 54.61,39.75 54.61,23.71 LV_LVLC5.6
  Top 0.305: LV_LVLC5.6 54.68,22.54 54.99,22.22 58.17,22.22 58.67,21.72 R44.1
ADR8OUT
  Top 0.254: X20.1 59.18,9.53 58.67,10.03 54.68,10.03 LV_LVLC5.3
ADR9
  Top 0.254: U$1.12 51.31,41.4 51.69,41.02 54.86,41.02 55.41,40.48 LV_LVLC5.5
  Top 0.305: LV_LVLC5.5 59.8,23.64 60.2,23.24 R45.1
ADR9OUT
  Top 0.254: X21.1 65.79,5.33 65.15,5.97 65.15,9.53 63.86,10.82 55.37,10.82 55.37,19.25 LV_LVLC5.4
ADR10
  Top 0.254: LV_LVLC6.5 63.99,53.59 | 63.99,53.59 63.99,56.37 64.52,56.9 R48.1 | U$1.13 52.58,47.88 51.94,48.51 51.94,53.72 52.45,54.23 63.36,54.23 63.99,53.59
ADR10OUT
  Top 0.305: LV_LVLC6.4 70.59,54.36 76.07,54.36 78.36,56.64 X23.1
GND  (via drill 0.5 pad 0.81, 0.61)
  Top 0.305: C11.2 46.96,38.37 46.48,38.37 | 46.48,38.37 C6.1 42.91,38.37 v42.67,38.61 | U$1.8 46.23,41.27 45.97,41.02 45.97,38.88 46.48,38.37 | C3.2 v47.62,67.18 | C12.2 49.62,38.73 v51.18,38.73 | ON.C v39.12,24.26 39.12,19.72 39.62,19.22 | C7.2 35.43,19.22 39.62,19.22 | 39.62,19.22 C4.2 | IC1.7 23.19,24.45 v23.11,24.38 | IC1.21 32.41,23.85 | LV_LVLC5.1 51.63,19.29 C14.2
  Top 0.406: RESET.4 RESET.3
  Top 0.508: C3.2 45.94,65.62 LV_LVLC3.1 | C4.2 41.8,19.22 LV_LVLC4.1 | C19.1 17.27,48.77 IC6.1 | C17.1 17.4,40.39 IC5.1 | C21.1 17.4,56.64 IC7.1 | U$1.19 48.77,53.34 C2.1
  other vias: 19.3,77.47 51.43,77.47 55.98,48.51 35.81,77.47 6.2,20.83 49.38,14.22 67.18,77.47 48.74,28.19 15.24,50.42 15.24,58.55 15.24,42.29 57.4,67.31 67.56,67.44 11.81,28.07 50.42,53.98 57.91,60.2 32.26,58.67 11.56,24 19.81,20.07
  pour Bottom (isolate 0.406, rank 2): 0.63,79.62 85.47,79.76 85.6,80.01 85.6,1.33 0.89,0.64 0.63,0.89
  pour Top (isolate 0.305, rank 2): 0.63,79.62 85.6,79.76 85.6,0.77 0.63,0.64 0.51,30.48
N$3
  Top 0.254: R2.2 ON.A
N$16
  Top 0.254: IC1.17 34.89,21.2 C7.1
N$17
  Top 0.305: R15.2 56.39,63.92 | 56.39,63.92 57.4,63.92 C1.1 | LV_LVLC1.7 LV_LVLC1.8 55.79,63.32 56.39,63.92
N$18
  Top 0.508: FUSIBLE.2 FERRITE.1
N$20
  Top 0.305: C3.1 46.35,63.92 | 46.35,63.92 R20.2 | LV_LVLC3.7 LV_LVLC3.8 45.88,63.45 46.35,63.92
N$31
  Top 0.305: C4.1 41.15,20.92 | 41.15,20.92 R23.2 | LV_LVLC4.7 LV_LVLC4.8 41.88,21.64 41.15,20.92
N$33
  Top 0.305: C14.1 53.21,20.92 | 53.21,20.92 R43.2 | LV_LVLC5.8 LV_LVLC5.7 54.03,21.73 53.21,20.92
N$35
  Top 0.254: R17.2 RX.A
N$36
  Top 0.254: R16.2 TX.A
N$37
  Top 0.254: C15.1 65.95,49.4 | 65.95,49.4 R46.2 | LV_LVLC6.7 LV_LVLC6.8 65.35,50 65.95,49.4
N$119
  Top 0.203: LV_LVLC2.7 LV_LVLC2.8
  Top 0.305: R71.2 66.29,64.05 | 66.29,64.05 67.44,64.05 C13.1 | LV_LVLC2.8 65.69,63.45 66.29,64.05
PGC/ADR6  (via drill 0.61)
  Top 0.254: X14.5 7.24,30.73 23.11,30.73 27.3,34.92 27.3,49.28 27.94,49.91 38.1,49.91 38.61,50.42 U$1.27 v38.61,53.98 | LV_LVLC4.6 43.25,26.87 v44.07,27.69
  Top 0.305: LV_LVLC4.6 43.25,22.66 43.69,22.22 46.86,22.22 47.37,21.72 R32.1
  Bottom 0.254: v44.07,27.69 38.61,33.15 v38.61,53.98
PGD/ADR7  (via drill 0.61)
  Top 0.254: X14.4 4.19,29.84 5.84,31.5 22.61,31.5 26.67,35.56 26.67,50.67 27.51,51.51 U$1.28 36.58,52.27 v36.58,53.98 | v44.07,25.78 43.98,25.69 LV_LVLC4.5
  Top 0.305: LV_LVLC4.5 48.5,23.64 48.89,23.24 R33.1
  Bottom 0.254: v36.58,53.98 36.58,33.27 v44.07,25.78
RESET  (via drill 0.61)
  Top 0.254: U$1.1 37.34,41.91 | 37.34,41.91 37.34,40.42 R3.2 | RESET.1 36.95,42.3 37.34,41.91 | v33.53,33.91 35.52,33.91 RESET.2
  Top 0.406: RESET.1 RESET.2
  Bottom 0.254: X14.1 7.11,25.53 25.15,25.53 v33.53,33.91
RX
  Top 0.254: IC1.1 26.96,28.36 27.94,29.34 27.94,48.26 28.57,48.89 49.66,48.89 50.04,49.28 U$1.18
RXLED
  Top 0.254: IC1.22 36.9,24.45 37.46,25.02 RX.C
TRIG0
  Top 0.254: X11.1 72.26,17.53 71.37,18.41 71.37,41.27 70.18,42.47 U$1.14
TRIG1
  Top 0.254: X12.1 78.23,37.21 71.37,44.07 55.63,44.07 53.85,45.85 U$1.15
TRIG2
  Top 0.254: R47.1 65.53,55.37 65.02,54.86 65.02,51.82 64.59,51.38 LV_LVLC6.6 61.78,51.38 59.82,53.34 52.96,53.34 52.58,52.96 U$1.16
TRIG2OUT
  Top 0.305: X22.1 73.79,48.89 71.3,51.38 LV_LVLC6.3
TX
  Top 0.254: U$1.17 51.31,48.77 50.67,48.13 29.46,48.13 28.83,47.5 28.83,26.29 28.29,25.75 IC1.5
TXLED
  Top 0.254: IC1.23 35.39,25.11 35.81,25.53 TX.C
USB_5V
  Top 0.432: J4.1 7.86,17.81 C8.1
  Top 0.508: C8.1 9.56,18.2 10.16,18.8 10.16,19.26 FUSIBLE.1
USBDM
  Top 0.254: J4.2 22.5,17.16 | 22.5,17.16 30.75,17.16 31.11,17.53 31.11,20.19 31.48,20.55 IC1.16 | C10.1 22.5,17.16
USBDP
  Top 0.254: J4.3 22.52,16.51 | 22.52,16.51 32.13,16.51 32.45,16.83 IC1.15 | C9.1 22.52,16.51
VDD_EXT
  Top 0.508: SV1.9 5.33,52.83 X6.1
VDD_REF  (via drill 0.35, 0.61)
  Top 0.254: LV_LVLC6.2 70.17,50.73 70.87,50.04 70.87,48.01 70.87,46.61 73.91,43.56 v81.28,43.56
  Top 0.305: LV_LVLC3.2 45.16,68.27 v45.47,68.58 45.72,68.83 C18.1 | LV_LVLC1.2 55.06,68.14 55.41,68.49 | 55.41,68.49 v55.5,68.58 | LV_LVLC2.2 64.97,68.02 v65.53,68.58 65.57,68.62 C22.1 | LV_LVLC4.2 42.58,19.27 42.58,17.53 42.07,17.02 v42.04,17.02 C25.1 | LV_LVLC5.2 54.03,17.45 v53.59,17.02 C24.1 | C20.1 55.41,68.49 | C23.1 71.08,48.22 70.87,48.01
  Top 0.508: SV1.2 SV1.4 SV1.6 SV1.8 SV1.10
  Bottom 0.254: v81.28,43.56 82.17,43.56 83.06,42.67
  Bottom 0.508: SV1.10 3.94,53.59 4.44,54.1 11.43,54.1 12.45,55.12 12.45,67.18 13.84,68.58 v45.47,68.58 v55.5,68.58 v65.53,68.58 82.17,68.58 83.06,67.69 83.06,42.67 83.06,23.5 82.3,22.73 67.06,22.73 61.34,17.02 v53.59,17.02 v42.04,17.02
XTAL1
  Top 0.254: U$1.10 48.77,40.64 | 48.77,40.64 48.39,40.26 48.39,36.58 49.78,35.18 Q1.2 | C12.1 48.77,40.6 48.77,40.64
XTAL2
  Top 0.254: U$1.9 47.5,40.64 | 47.5,40.64 47.88,40.26 47.88,36.58 46.48,35.18 Q1.1 | C11.1 47.5,40.6 47.5,40.64

### Text on the board
tNames: RX | TX | L
bNames: M. Bocquet
214bmp: D:/SmartProjects/Snc/a4_bn_logo2.bmp